# EAGLE design LTC6811_slave_12s_rev1 (EAGLE 9.3.1)

## Sheet 1 of 2
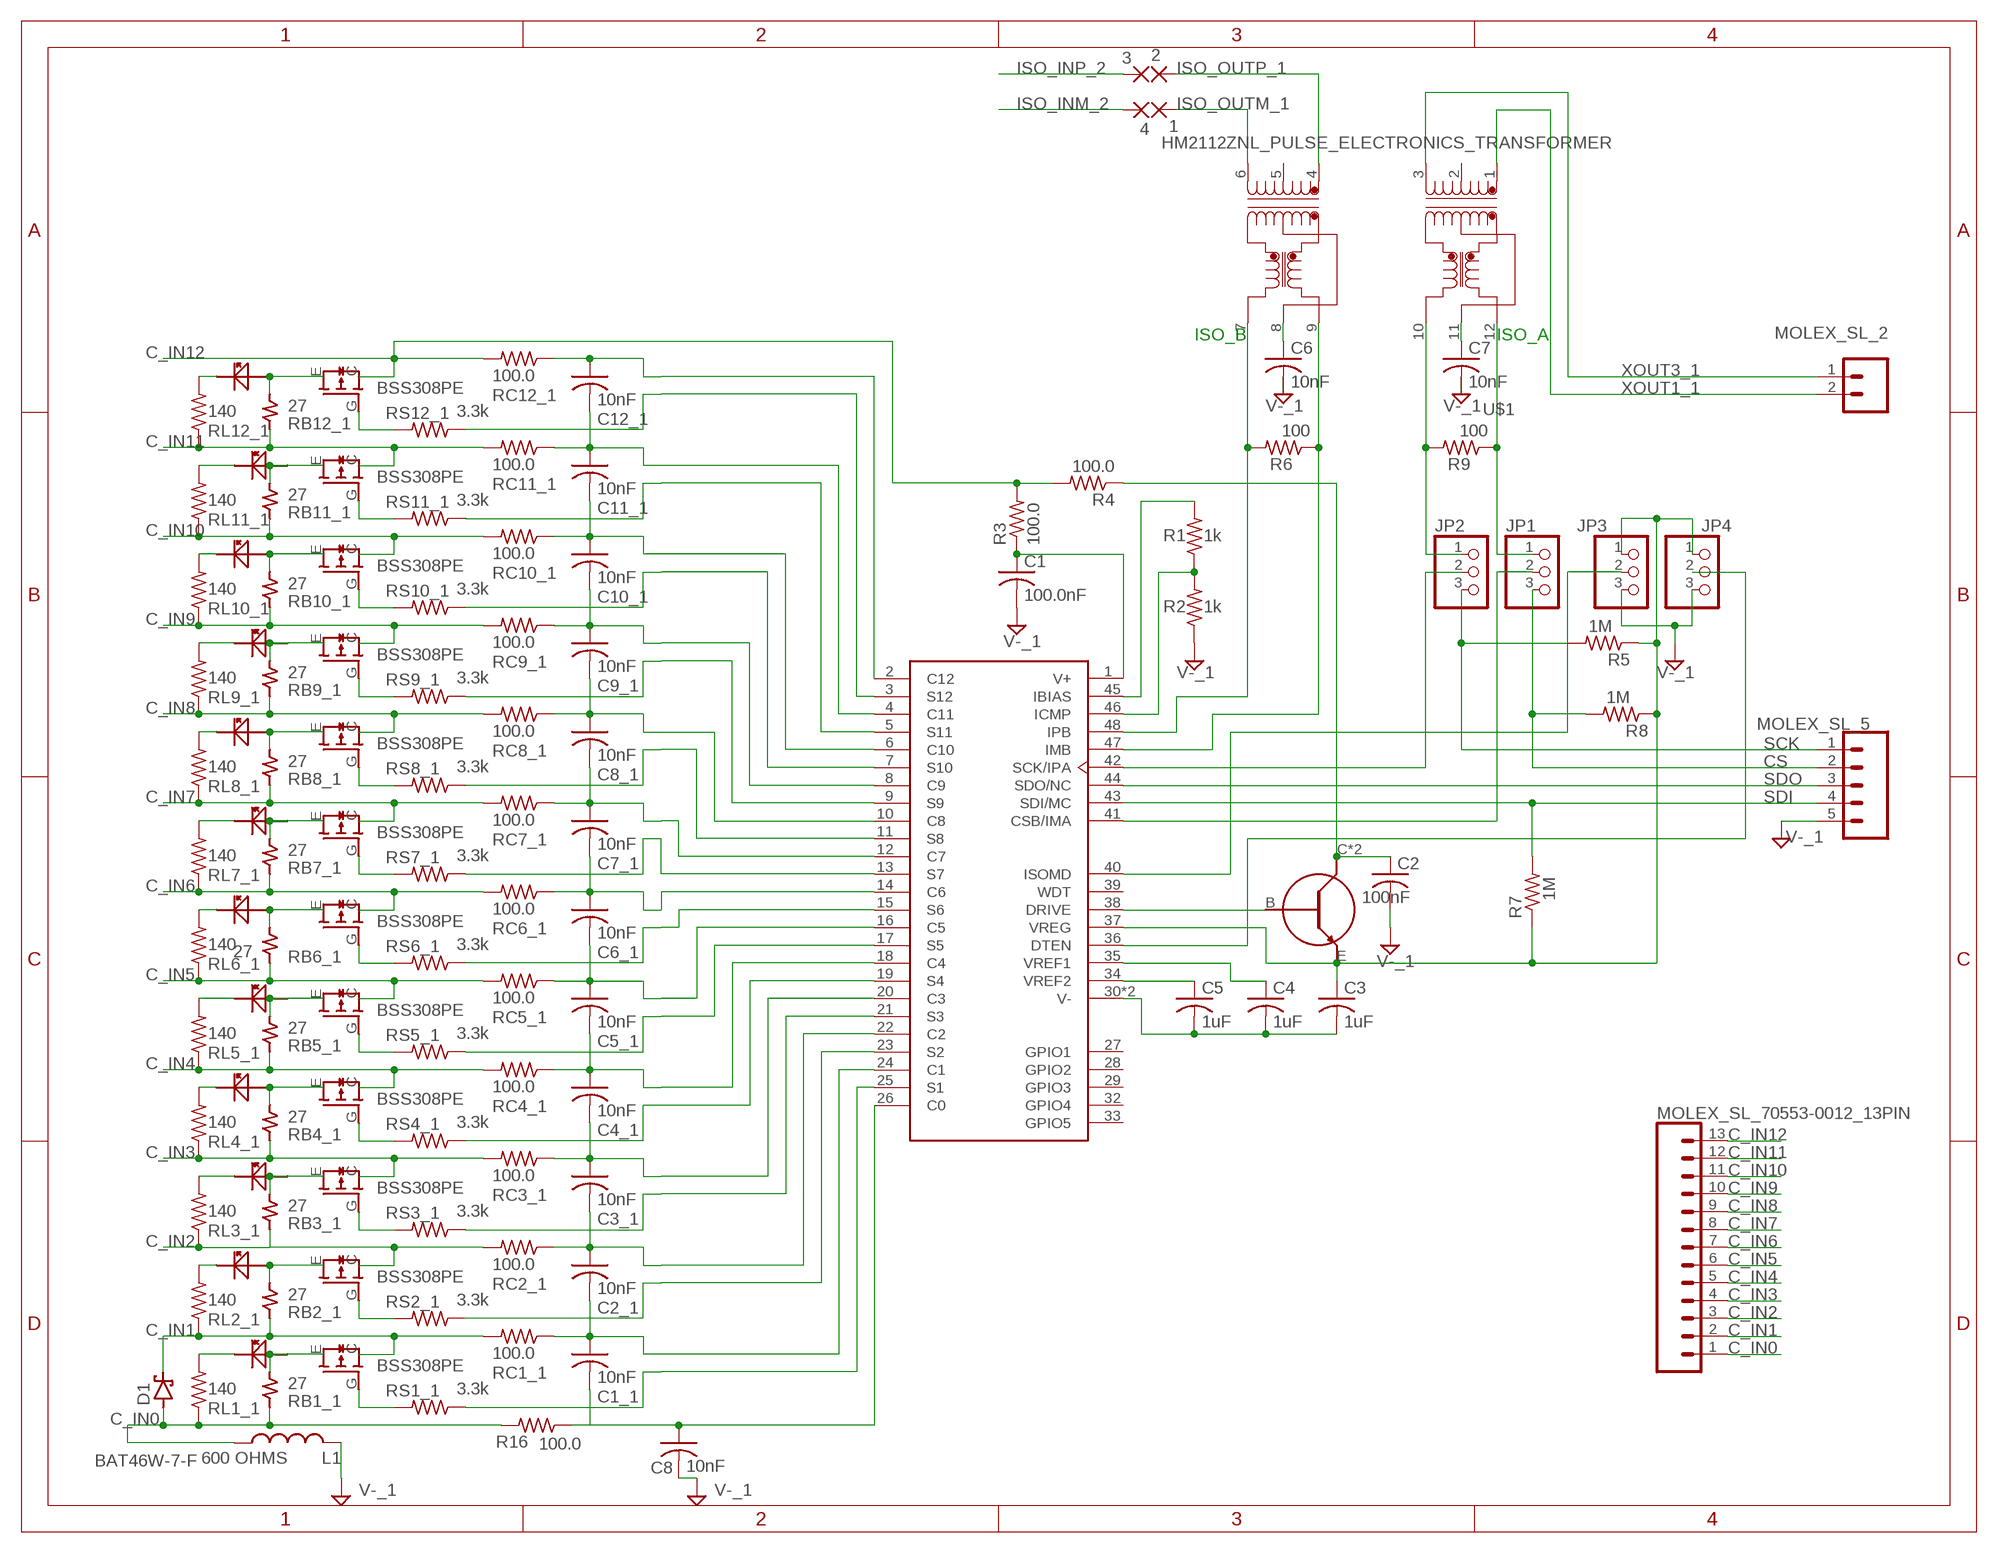
[diagram p0: schematic, sheet 1]

### Parts
1  WIREPAD2,15/1,0  [2,15/1,0]
2  WIREPAD2,15/1,0  [2,15/1,0]
3  WIREPAD2,15/1,0  [2,15/1,0]
4  WIREPAD2,15/1,0  [2,15/1,0]
C1  100.0nF  C-USC0805  [C0805]
C1_1  10nF  C-USC0805  [C0805]
C2  100nF  C-USC0805  [C0805]
C2_1  10nF  C-USC0805  [C0805]
C3  1uF  C-USC0805  [C0805]
C3_1  10nF  C-USC0805  [C0805]
C4  1uF  C-USC0805  [C0805]
C4_1  10nF  C-USC0805  [C0805]
C5  1uF  C-USC0805  [C0805]
C5_1  10nF  C-USC0805  [C0805]
C6  10nF  C-USC0805  [C0805]
C6_1  10nF  C-USC0805  [C0805]
C7  10nF  C-USC0805  [C0805]
C7_1  10nF  C-USC0805  [C0805]
C8  10nF  C-USC0805  [C0805]
C8_1  10nF  C-USC0805  [C0805]
C9_1  10nF  C-USC0805  [C0805]
C10_1  10nF  C-USC0805  [C0805]
C11_1  10nF  C-USC0805  [C0805]
C12_1  10nF  C-USC0805  [C0805]
D1  BAT46W-7-F  [SOD123]
DZT5551-13  DZT5551-13  [SOT223-4]
JP1  PINHD-1X3  [1X03]
JP2  PINHD-1X3  [1X03]
JP3  PINHD-1X3  [1X03]
JP4  PINHD-1X3  [1X03]
L1  600 OHMS  0805_FERRITEBEAD_INDUCTOR  [0805_COMPONENT]
LED1_3  LED_0805  [0805_COMPONENT]
LED1_4  LED_0805  [0805_COMPONENT]
LED1_5  LED_0805  [0805_COMPONENT]
LED1_6  LED_0805  [0805_COMPONENT]
LED1_7  LED_0805  [0805_COMPONENT]
LED1_8  LED_0805  [0805_COMPONENT]
LED1_9  LED_0805  [0805_COMPONENT]
LED1_10  LED_0805  [0805_COMPONENT]
LED1_11  LED_0805  [0805_COMPONENT]
LED1_12  LED_0805  [0805_COMPONENT]
LED1_13  LED_0805  [0805_COMPONENT]
LED1_14  LED_0805  [0805_COMPONENT]
MOLEX_SL_2  CONN_02  [1X02]
MOLEX_SL_5  CONN_05  [1X05]
MOLEX_SL_70553-0012_13PIN  CONN_13  [1X13]
R1  1k  R-US_R0805  [R0805]
R2  1k  R-US_R0805  [R0805]
R3  100.0  R-US_R0805  [R0805]
R4  100.0  R-US_R0805  [R0805]
R5  1M  R-US_R0805  [R0805]
R6  100  R-US_R0805  [R0805]
R7  1M  R-US_R0805  [R0805]
R8  1M  R-US_R0805  [R0805]
R9  100  R-US_R0805  [R0805]
R16  100.0  R-US_R0805  [R0805]
RB1_1  27  2817_RESISTOR  [2817_COMPONENT]
RB2_1  27  2817_RESISTOR  [2817_COMPONENT]
RB3_1  27  2817_RESISTOR  [2817_COMPONENT]
RB4_1  27  2817_RESISTOR  [2817_COMPONENT]
RB5_1  27  2817_RESISTOR  [2817_COMPONENT]
RB6_1  27  2817_RESISTOR  [2817_COMPONENT]
RB7_1  27  2817_RESISTOR  [2817_COMPONENT]
RB8_1  27  2817_RESISTOR  [2817_COMPONENT]
RB9_1  27  2817_RESISTOR  [2817_COMPONENT]
RB10_1  27  2817_RESISTOR  [2817_COMPONENT]
RB11_1  27  2817_RESISTOR  [2817_COMPONENT]
RB12_1  27  2817_RESISTOR  [2817_COMPONENT]
RC1_1  100.0  R-US_R0805  [R0805]
RC2_1  100.0  R-US_R0805  [R0805]
RC3_1  100.0  R-US_R0805  [R0805]
RC4_1  100.0  R-US_R0805  [R0805]
RC5_1  100.0  R-US_R0805  [R0805]
RC6_1  100.0  R-US_R0805  [R0805]
RC7_1  100.0  R-US_R0805  [R0805]
RC8_1  100.0  R-US_R0805  [R0805]
RC9_1  100.0  R-US_R0805  [R0805]
RC10_1  100.0  R-US_R0805  [R0805]
RC11_1  100.0  R-US_R0805  [R0805]
RC12_1  100.0  R-US_R0805  [R0805]
RL1_1  140  R-US_R0805  [R0805]
RL2_1  140  R-US_R0805  [R0805]
RL3_1  140  R-US_R0805  [R0805]
RL4_1  140  R-US_R0805  [R0805]
RL5_1  140  R-US_R0805  [R0805]
RL6_1  140  R-US_R0805  [R0805]
RL7_1  140  R-US_R0805  [R0805]
RL8_1  140  R-US_R0805  [R0805]
RL9_1  140  R-US_R0805  [R0805]
RL10_1  140  R-US_R0805  [R0805]
RL11_1  140  R-US_R0805  [R0805]
RL12_1  140  R-US_R0805  [R0805]
RS1_1  3.3k  R-US_R0805  [R0805]
RS2_1  3.3k  R-US_R0805  [R0805]
RS3_1  3.3k  R-US_R0805  [R0805]
RS4_1  3.3k  R-US_R0805  [R0805]
RS5_1  3.3k  R-US_R0805  [R0805]
RS6_1  3.3k  R-US_R0805  [R0805]
RS7_1  3.3k  R-US_R0805  [R0805]
RS8_1  3.3k  R-US_R0805  [R0805]
RS9_1  3.3k  R-US_R0805  [R0805]
RS10_1  3.3k  R-US_R0805  [R0805]
RS11_1  3.3k  R-US_R0805  [R0805]
RS12_1  3.3k  R-US_R0805  [R0805]
T1_3  BSS308PEH6327  [SOT23]
T1_4  BSS308PEH6327  [SOT23]
T1_5  BSS308PEH6327  [SOT23]
T1_6  BSS308PEH6327  [SOT23]
T1_7  BSS308PEH6327  [SOT23]
T1_8  BSS308PEH6327  [SOT23]
T1_9  BSS308PEH6327  [SOT23]
T1_10  BSS308PEH6327  [SOT23]
T1_11  BSS308PEH6327  [SOT23]
T1_12  BSS308PEH6327  [SOT23]
T1_13  BSS308PEH6327  [SOT23]
T1_14  BSS308PEH6327  [SOT23]
U1  LTC6811HG-2#PBF  [LTC6811-1]
U$1  HM2112ZNL_PULSE_ELECTRONICS_TRANSFORMER  [HM2112ZNL_12SMT]

### Nets
C0: C8.1 R16.1 U1.26(C0)
C1: C1_1.1 C2_1.2 RC1_1.1 U1.24(C1)
C2: C2_1.1 C3_1.2 RC2_1.1 U1.22(C2)
C3: C3_1.1 C4_1.2 RC3_1.1 U1.20(C3)
C4: C4_1.1 C5_1.2 RC4_1.1 U1.18(C4)
C5: C5_1.1 C6_1.2 RC5_1.1 U1.16(C5)
C6: C6_1.1 C7_1.2 RC6_1.1 U1.14(C6)
C7: C7_1.1 C8_1.2 RC7_1.1 U1.12(C7)
C8: C8_1.1 C9_1.2 RC8_1.1 U1.10(C8)
C9: C9_1.1 C10_1.2 RC9_1.1 U1.8(C9)
C10: C10_1.1 C11_1.2 RC10_1.1 U1.6(C10)
C11: C11_1.1 C12_1.2 RC11_1.1 U1.4(C11)
C12: C12_1.1 RC12_1.1 U1.2(C12)
C_IN0: D1.A L1.1 MOLEX_SL_70553-0012_13PIN.1 R16.2 RB1_1.2 RL1_1.1
C_IN1: D1.C MOLEX_SL_70553-0012_13PIN.2 RB2_1.2 RC1_1.2 RL2_1.1 T1_3.C
C_IN2: MOLEX_SL_70553-0012_13PIN.3 RB3_1.2 RC2_1.2 RL3_1.1 T1_4.C
C_IN3: MOLEX_SL_70553-0012_13PIN.4 RB4_1.2 RC3_1.2 RL4_1.1 T1_7.C
C_IN4: MOLEX_SL_70553-0012_13PIN.5 RB5_1.2 RC4_1.2 RL5_1.1 T1_8.C
C_IN5: MOLEX_SL_70553-0012_13PIN.6 RB6_1.2 RC5_1.2 RL6_1.1 T1_5.C
C_IN6: MOLEX_SL_70553-0012_13PIN.7 RB7_1.2 RC6_1.2 RL7_1.1 T1_6.C
C_IN7: MOLEX_SL_70553-0012_13PIN.8 RB8_1.2 RC7_1.2 RL8_1.1 T1_9.C
C_IN8: MOLEX_SL_70553-0012_13PIN.9 RB9_1.2 RC8_1.2 RL9_1.1 T1_10.C
C_IN9: MOLEX_SL_70553-0012_13PIN.10 RB10_1.2 RC9_1.2 RL10_1.1 T1_11.C
C_IN10: MOLEX_SL_70553-0012_13PIN.11 RB11_1.2 RC10_1.2 RL11_1.1 T1_12.C
C_IN11: MOLEX_SL_70553-0012_13PIN.12 RB12_1.2 RC11_1.2 RL12_1.1 T1_13.C
C_IN12: MOLEX_SL_70553-0012_13PIN.13 R3.2 R4.2 RC12_1.2 T1_14.C
CS: JP1.3 MOLEX_SL_5.2 R8.2
CS_OR_IMA: JP1.2 U1.41(CSB/IMA)
DRIVE: DZT5551-13.B U1.38(DRIVE)
DTEN: JP4.2 U1.36(DTEN)
IBIAS: R1.2 U1.45(IBIAS)
ICMP: R1.1 R2.2 U1.46(ICMP)
IMB: R6.1 U1.47(IMB) U$1.9
IPB: R6.2 U1.48(IPB) U$1.7
ISO_INM_2: 4.1(P)
ISO_INP_2: 3.1(P)
ISO_OUTM_1: 1.1(P) U$1.6
ISO_OUTP_1: 2.1(P) U$1.4
ISOMD: JP3.2 U1.40(ISOMD)
N$3: C6.1 U$1.8
N$5: C1.1 R3.1 U1.1(V+)
N$7: JP2.1 R9.2 U$1.10
N$8: JP1.1 R9.1 U$1.12
N$9: C7.1 U$1.11
N$32: LED1_11.2 RB9_1.1 T1_11.E
N$33: RS9_1.2 T1_11.G(B)
N$34: LED1_11.1 RL9_1.2
N$35: LED1_12.2 RB10_1.1 T1_12.E
N$36: RS10_1.2 T1_12.G(B)
N$37: LED1_12.1 RL10_1.2
N$39: LED1_13.2 RB11_1.1 T1_13.E
N$40: LED1_3.2 RB1_1.1 T1_3.E
N$41: RS1_1.2 T1_3.G(B)
N$42: LED1_3.1 RL1_1.2
N$43: LED1_4.2 RB2_1.1 T1_4.E
N$44: RS2_1.2 T1_4.G(B)
N$45: LED1_4.1 RL2_1.2
N$46: C1_1.2
N$48: LED1_5.2 RB5_1.1 T1_5.E
N$49: RS5_1.2 T1_5.G(B)
N$50: LED1_5.1 RL5_1.2
N$51: LED1_6.2 RB6_1.1 T1_6.E
N$52: RS6_1.2 T1_6.G(B)
N$53: LED1_6.1 RL6_1.2
N$55: LED1_9.2 RB7_1.1 T1_9.E
N$56: LED1_7.2 RB3_1.1 T1_7.E
N$57: RS3_1.2 T1_7.G(B)
N$58: LED1_7.1 RL3_1.2
N$59: LED1_8.2 RB4_1.1 T1_8.E
N$60: RS4_1.2 T1_8.G(B)
N$61: LED1_8.1 RL4_1.2
N$62: RS11_1.2 T1_13.G(B)
N$63: RS7_1.2 T1_9.G(B)
N$64: LED1_9.1 RL7_1.2
N$65: LED1_10.2 RB8_1.1 T1_10.E
N$66: RS8_1.2 T1_10.G(B)
N$67: LED1_10.1 RL8_1.2
N$69: LED1_13.1 RL11_1.2
N$70: LED1_14.2 RB12_1.1 T1_14.E
N$71: RS12_1.2 T1_14.G(B)
N$72: LED1_14.1 RL12_1.2
S1: RS1_1.1 U1.25(S1)
S2: RS2_1.1 U1.23(S2)
S3: RS3_1.1 U1.21(S3)
S4: RS4_1.1 U1.19(S4)
S5: RS5_1.1 U1.17(S5)
S6: RS6_1.1 U1.15(S6)
S7: RS7_1.1 U1.13(S7)
S8: RS8_1.1 U1.11(S8)
S9: RS9_1.1 U1.9(S9)
S10: RS10_1.1 U1.7(S10)
S11: RS11_1.1 U1.5(S11)
S12: RS12_1.1 U1.3(S12)
SCK: JP2.3 MOLEX_SL_5.1 R5.2
SCK_OR_IPA: JP2.2 U1.42(SCK/IPA)
SDI: MOLEX_SL_5.4 R7.2 U1.43(SDI/MC)
SDO: MOLEX_SL_5.3 U1.44(SDO/NC)
V-_1: C1.2 C2.2 C3.2 C4.2 C5.2 C6.2 C7.2 C8.2 JP3.3 JP4.3 L1.2 MOLEX_SL_5.5 R2.1 U1.30(V-) U1.31(V-) ; supply symbol labelled GND
VREF1_C4: C4.1 U1.35(VREF1)
VREF2_C5: C5.1 U1.34(VREF2)
VREG: C3.1 DZT5551-13.E JP3.1 JP4.1 R5.1 R7.1 R8.1 U1.37(VREG)
VREG_CAP: C2.1 DZT5551-13.C DZT5551-13.C@2(C) R4.1
XOUT1_1: MOLEX_SL_2.2 U$1.1
XOUT3_1: MOLEX_SL_2.1 U$1.3
Unconnected: U1.27(GPIO1) U1.28(GPIO2) U1.29(GPIO3) U1.32(GPIO4) U1.33(GPIO5) U1.39(WDT) U$1.2 U$1.5

### Notes on the sheet
- ISO_B | ISO_A

## Sheet 2 of 2

## Library data of the parts
1-4 = wirepad:WIREPAD: Wire PAD connect wire on PCB
C1 C1_1 C2 C2_1 C3 C3_1 C4 C4_1 C5 C5_1 C6 C6_1 C7 C7_1 C8 C8_1 C9_1 C10_1 C11_1 C12_1 = resistor:C-US: CAPACITOR, American symbol
D1 = Library_Capstone:BAT46W-7-F
DZT5551-13 = Library_Capstone:DZT5551-13
JP1-JP4 = pinhead:PINHD-1X3: PIN HEADER
L1 = Library_Capstone:0805_FERRITEBEAD_INDUCTOR
LED1_3-LED1_14 = Library_Capstone:LED_0805
MOLEX_SL_2 = SparkFun-Connectors:CONN_02: Multi connection point. Often used as Generic Header-pin footprint for 0.1 inch spaced/style header connections On any of the 0.1 inch spaced packages, you can populate with these: Break Away Headers - Straight <https://www.sparkfun.com/products/116> (PRT-00116) Break Away Male Headers - Right Angle <https://www.sparkfun.com/products/553> (PRT-00553) Female Headers <https://www.sparkfun.com/products/115> (PRT-00115) Break Away Headers - Machine Pin <https://www.sparkfun.com/products/117> (PRT-00117) Break Away Female Headers - Swiss Machine Pin <https://www.sparkfun.com/products/743> (PRT-00743) For SCREWTERMINALS and SPRING TERMINALS visit here: Screw Terimnals on SparkFun.com <https://www.sparkfun.com/search/results?term=Screw+Terminals> (5mm/3.5mm/2.54mm spacing) This device is also useful as a general connection point to wire up your design to another part of your project. Our various solder wires solder well into these plated through hole pads. Hook-Up Wire - Assortment (Stranded, 22 AWG) <https://www.sparkfun.com/products/11375> (PRT-11375) Hook-Up Wire - Assortment (Solid Core, 22 AWG) <https://www.sparkfun.com/products/11367> (PRT-11367) View the entire wire category on our website here <https://www.sparkfun.com/categories/141> Special notes: Molex polarized connector foot print use with: PRT-08233 with associated crimp pins and housings. 2.54_SCREWTERM for use with PRT-10571. 3.5mm Screw Terminal footprints for PRT-08084 5mm Screw Terminal footprints for use with PRT-08432
MOLEX_SL_5 = SparkFun-Connectors:CONN_05: Multi connection point. Often used as Generic Header-pin footprint for 0.1 inch spaced/style header connections On any of the 0.1 inch spaced packages, you can populate with these: Break Away Headers - Straight <https://www.sparkfun.com/products/116> (PRT-00116) Break Away Male Headers - Right Angle <https://www.sparkfun.com/products/553> (PRT-00553) Female Headers <https://www.sparkfun.com/products/115> (PRT-00115) Break Away Headers - Machine Pin <https://www.sparkfun.com/products/117> (PRT-00117) Break Away Female Headers - Swiss Machine Pin <https://www.sparkfun.com/products/743> (PRT-00743) For SCREWTERMINALS and SPRING TERMINALS visit here: Screw Terimnals on SparkFun.com <https://www.sparkfun.com/search/results?term=Screw+Terminals> (5mm/3.5mm/2.54mm spacing) This device is also useful as a general connection point to wire up your design to another part of your project. Our various solder wires solder well into these plated through hole pads. Hook-Up Wire - Assortment (Stranded, 22 AWG) <https://www.sparkfun.com/products/11375> (PRT-11375) Hook-Up Wire - Assortment (Solid Core, 22 AWG) <https://www.sparkfun.com/products/11367> (PRT-11367) View the entire wire category on our website here <https://www.sparkfun.com/categories/141> Special notes: Molex polarized connector foot print use with SKU : PRT-08231 with associated crimp pins and housings. 1MM SMD Version SKU: PRT-10208
MOLEX_SL_70553-0012_13PIN = SparkFun-Connectors:CONN_13: Multi connection point. Often used as Generic Header-pin footprint for 0.1 inch spaced/style header connections On any of the 0.1 inch spaced packages, you can populate with these: Break Away Headers - Straight <https://www.sparkfun.com/products/116> (PRT-00116) Break Away Male Headers - Right Angle <https://www.sparkfun.com/products/553> (PRT-00553) Female Headers <https://www.sparkfun.com/products/115> (PRT-00115) Break Away Headers - Machine Pin <https://www.sparkfun.com/products/117> (PRT-00117) Break Away Female Headers - Swiss Machine Pin <https://www.sparkfun.com/products/743> (PRT-00743) For SCREWTERMINALS and SPRING TERMINALS visit here: Screw Terimnals on SparkFun.com <https://www.sparkfun.com/search/results?term=Screw+Terminals> (5mm/3.5mm/2.54mm spacing) This device is also useful as a general connection point to wire up your design to another part of your project. Our various solder wires solder well into these plated through hole pads. Hook-Up Wire - Assortment (Stranded, 22 AWG) <https://www.sparkfun.com/products/11375> (PRT-11375) Hook-Up Wire - Assortment (Solid Core, 22 AWG) <https://www.sparkfun.com/products/11367> (PRT-11367) View the entire wire category on our website here <https://www.sparkfun.com/categories/141> Special notes: Molex polarized connector foot print use with SKU : PRT-08231 with associated crimp pins and housings. 1MM SMD Version SKU: PRT-10208 NOTES ON THE VARIANTS LOCK and LOCK_LONGPADS... This footprint was designed to help hold the alignment of a through-hole component (i.e. 6-pin header) while soldering it into place. You may notice that each hole has been shifted either up or down by 0.005 of an inch from it's more standard position (which is a perfectly straight line). This slight alteration caused the pins (the squares in the middle) to touch the edges of the holes. Because they are alternating, it causes a "brace" to hold the component in place. 0.005 has proven to be the perfect amount of "off-center" position when using our standard breakaway headers. Although looks a little odd when you look at the bare footprint, once you have a header in there, the alteration is very hard to notice. Also,if you push a header all the way into place, it is covered up entirely on the bottom side.
R1-R9 R16 RC1_1 RC2_1 RC3_1 RC4_1 RC5_1 RC6_1 RC7_1 RC8_1 RC9_1 RC10_1 RC11_1 RC12_1 RL1_1 RL2_1 RL3_1 RL4_1 RL5_1 RL6_1 RL7_1 RL8_1 RL9_1 RL10_1 RL11_1 RL12_1 RS1_1 RS2_1 RS3_1 RS4_1 RS5_1 RS6_1 RS7_1 RS8_1 RS9_1 RS10_1 RS11_1 RS12_1 = resistor:R-US_: RESISTOR, American symbol
RB1_1 RB2_1 RB3_1 RB4_1 RB5_1 RB6_1 RB7_1 RB8_1 RB9_1 RB10_1 RB11_1 RB12_1 = Library_Capstone:2817_RESISTOR
T1_3-T1_14 = Library_Capstone:BSS308PEH6327
U1 = LTC6811HG-2_PBF:LTC6811HG-2#PBF: LTC6811-1/LTC6811-2 - Multicell Battery Monitors; AVAILABILITY: Unavailable; DESCRIPTION: LTC6811-1/LTC6811-2 - Multicell Battery Monitors; MF: Linear Technology/Analog; MP: LTC6811HG-2#PBF; PACKAGE: SSOP-48 Linear Technology; PRICE: None
U$1 = HM2112ZNL:HM2112ZNL_PULSE_ELECTRONICS_TRANSFORMER

## Board
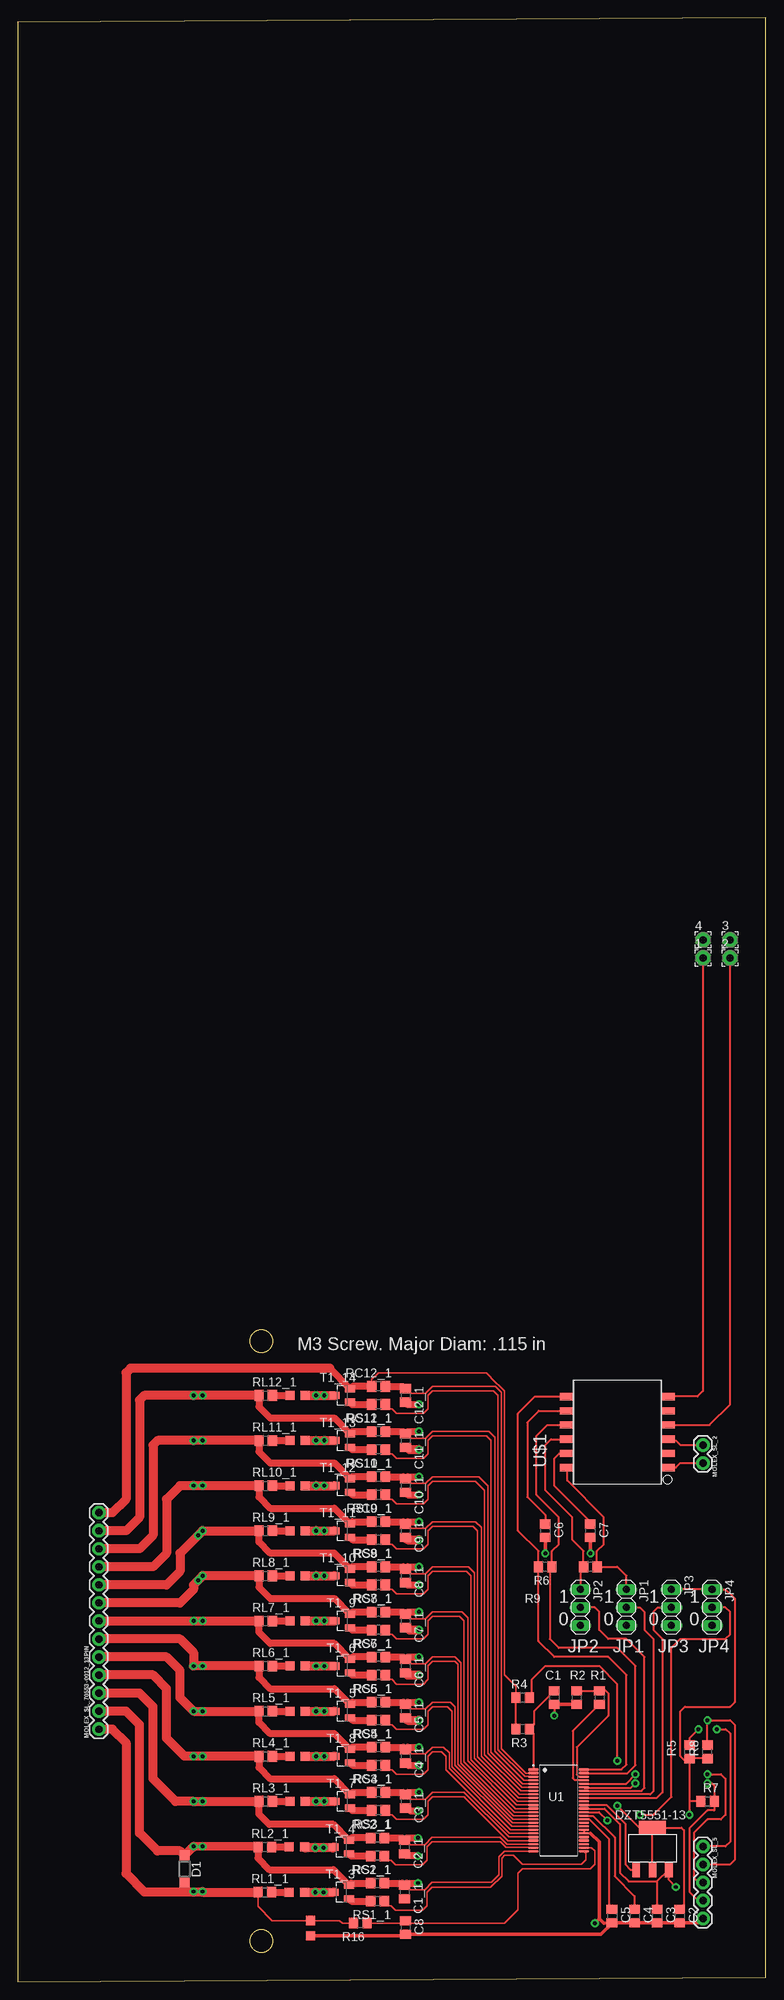
[diagram p1: board, top side]
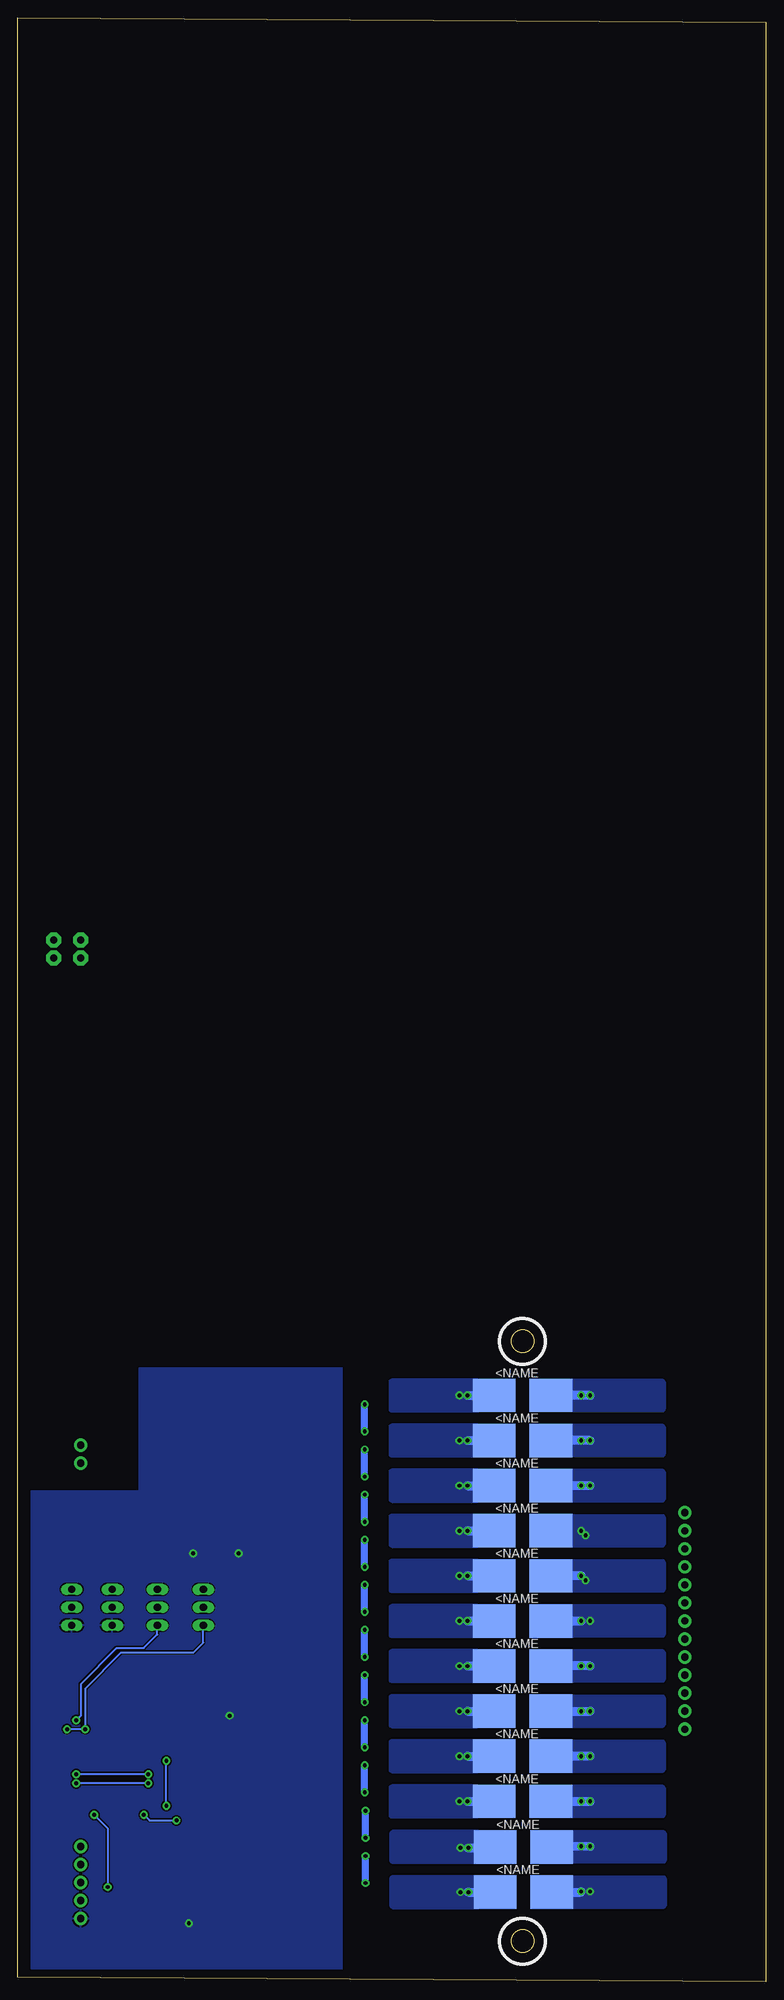
[diagram p2: board, bottom side, seen from below]

Size 105.39 x 276.53 mm. Coordinates in mm from the lower left corner, seen from the top.
Outline: 0,0 105.39,0.64 105.39,276.53 0,275.89 0,0
Outline: circle at 34.29,90.17 radius 1.59
Outline: circle at 34.29,5.72 radius 1.59
Copper layers (1*16): Top 0.035mm / dielectric 1.5mm / Bottom 0.035mm
Design rules "default *": minimum track width 6mil, minimum drill 0.53mm, track to track 8mil, track to pad 6mil, pad to pad 6mil, via to via 6mil, smd to smd 6mil, copper to edge 40mil, drill to drill 6mil, minimum pad ring 10mil, minimum via ring 8mil, stop-mask expansion 4mil, vias tented up to drill 0mil, thermal gap 10mil

### Footprints (pad centres in the part's own frame; a part is rotated, then mirrored left to right if it is on the bottom)
2,15/1,0 = drill 1.016 pad 2.159 octagon: 1 0,0
C0805 = smd 1.3 x 1.5: 1 -0.95,0; 2 0.95,0
SOD123 = smd 1.4 x 1.4: A 1.9,0; C -1.9,0
SOT223-4 = smd 1.067 x 2.184: B -2.3,-3; C@2 0,-3; E 2.3,-3 | smd 3.81 x 1.93: C 0,2.9
1X03 = drill 1.016 long: 1 -2.54,0; 2 0,0; 3 2.54,0
0805_COMPONENT = smd 1.27 x 1.27: 1 -1,0; 2 1.127,0
1X02 = drill 1.016 pad 1.88: 1 0,0; 2 2.54,0
1X05 = drill 1.016 pad 1.88: 1 0,0; 2 2.54,0; 3 5.08,0; 4 7.62,0; 5 10.16,0
1X13 = drill 1.016 pad 1.88: 1 0,0; 2 2.54,0; 3 5.08,0; 4 7.62,0; 5 10.16,0; 6 12.7,0; 7 15.24,0; 8 17.78,0; 9 20.32,0; 10 22.86,0; 11 25.4,0; 12 27.94,0; 13 30.48,0
R0805 = smd 1.3 x 1.5: 1 -0.95,0; 2 0.95,0
2817_COMPONENT = smd 6 x 4.7: 1 -4,0; 2 4,0
SOT23 = smd 1 x 1.4: C 0.95,-1.1; E 0,1.1; G -0.95,-1.1
LTC6811-1 = smd 1.44 x 0.34: 1 -3.54,5.75; 2 -3.54,5.25; 3 -3.54,4.75; 4 -3.54,4.25; 5 -3.54,3.75; 6 -3.54,3.25; 7 -3.54,2.75; 8 -3.54,2.25; 9 -3.54,1.75; 10 -3.54,1.25; 11 -3.54,0.75; 12 -3.54,0.25; 13 -3.54,-0.25; 14 -3.54,-0.75; 15 -3.54,-1.25; 16 -3.54,-1.75; 17 -3.54,-2.25; 18 -3.54,-2.75; 19 -3.54,-3.25; 20 -3.54,-3.75; 21 -3.54,-4.25; 22 -3.54,-4.75; 23 -3.54,-5.25; 24 -3.54,-5.75; 25 3.54,-5.75; 26 3.54,-5.25; 27 3.54,-4.75; 28 3.54,-4.25; 29 3.54,-3.75; 30 3.54,-3.25; 31 3.54,-2.75; 32 3.54,-2.25; 33 3.54,-1.75; 34 3.54,-1.25; 35 3.54,-0.75; 36 3.54,-0.25; 37 3.54,0.25; 38 3.54,0.75; 39 3.54,1.25; 40 3.54,1.75; 41 3.54,2.25; 42 3.54,2.75; 43 3.54,3.25; 44 3.54,3.75; 45 3.54,4.25; 46 3.54,4.75; 47 3.54,5.25; 48 3.54,5.75
HM2112ZNL_12SMT = smd 1.02 x 1.89: 1 0,-7.145; 2 2,-7.145; 3 4,-7.145; 4 6,-7.145; 5 8,-7.145; 6 10,-7.145; 7 10,7.145; 8 8,7.145; 9 6,7.145; 10 4,7.145; 11 2,7.145; 12 0,7.145

### Placement (x,y rotation side)
1  96.52,144.14 0 top
2  100.33,144.14 0 top
3  100.33,146.69 0 top
4  96.52,146.69 0 top
C1  75.56,40.01 270 top
C1_1  54.48,12.62 270 top
C2  93.22,9.27 270 top
C2_1  54.48,18.97 270 top
C3  90.04,9.27 270 top
C3_1  54.61,25.4 270 top
C4  86.87,9.27 270 top
C4_1  54.61,31.75 270 top
C5  83.69,9.27 270 top
C5_1  54.61,38.1 270 top
C6  74.3,63.5 270 top
C6_1  54.61,44.45 270 top
C7  80.64,63.5 270 top
C7_1  54.61,50.8 270 top
C8  54.61,7.62 270 top
C8_1  54.61,57.15 270 top
C9_1  54.61,63.5 270 top
C10_1  54.61,69.85 270 top
C11_1  54.61,76.2 270 top
C12_1  54.61,82.55 270 top
D1  23.5,15.88 270 top
DZT5551-13  89.41,18.8 0 top
JP1  85.72,52.71 270 top
JP2  79.25,52.71 270 top
JP3  92.08,52.71 270 top
JP4  97.79,52.71 270 top
L1  41.27,7.62 270 top
LED1_3  39.24,12.62 0 top
LED1_4  39.24,18.97 0 top
LED1_5  39.37,38.1 0 top
LED1_6  39.37,44.45 0 top
LED1_7  39.37,25.4 0 top
LED1_8  39.37,31.75 0 top
LED1_9  39.37,50.8 0 top
LED1_10  39.37,57.15 0 top
LED1_11  39.37,63.5 0 top
LED1_12  39.37,69.85 0 top
LED1_13  39.37,76.2 0 top
LED1_14  39.37,82.55 0 top
MOLEX_SL_2  96.52,75.56 270 top
MOLEX_SL_5  96.52,19.05 270 top
MOLEX_SL_70553-0012_13PIN  11.43,35.56 90 top
R1  81.91,40.01 270 top
R2  78.74,40.01 90 top
R3  71.12,35.56 180 top
R4  71.12,40.01 180 top
R5  94.61,32.39 90 top
R6  74.3,58.42 180 top
R7  97.16,25.4 0 top
R8  97.16,32.39 90 top
R9  80.64,58.42 180 top
R16  48.26,8.25 180 top
RB1_1  34.16,12.62 0 bottom
RB2_1  34.16,18.97 0 bottom
RB3_1  34.29,25.4 0 bottom
RB4_1  34.29,31.75 0 bottom
RB5_1  34.29,38.1 0 bottom
RB6_1  34.29,44.45 0 bottom
RB7_1  34.29,50.8 0 bottom
RB8_1  34.29,57.15 0 bottom
RB9_1  34.29,63.5 0 bottom
RB10_1  34.29,69.85 0 bottom
RB11_1  34.29,76.2 0 bottom
RB12_1  34.29,82.55 0 bottom
RC1_1  50.67,13.89 180 top
RC2_1  50.67,20.24 180 top
RC3_1  50.8,26.67 180 top
RC4_1  50.8,33.02 180 top
RC5_1  50.8,39.37 180 top
RC6_1  50.8,45.72 180 top
RC7_1  50.8,52.07 180 top
RC8_1  50.8,58.42 180 top
RC9_1  50.8,64.77 180 top
RC10_1  50.8,71.12 180 top
RC11_1  50.8,77.47 180 top
RC12_1  50.8,83.82 180 top
RL1_1  34.8,12.62 0 top
RL2_1  34.8,18.97 0 top
RL3_1  34.92,25.4 0 top
RL4_1  34.92,31.75 0 top
RL5_1  34.92,38.1 0 top
RL6_1  34.92,44.45 0 top
RL7_1  34.92,50.8 0 top
RL8_1  34.92,57.15 0 top
RL9_1  34.92,63.5 0 top
RL10_1  34.92,69.85 0 top
RL11_1  34.92,76.2 0 top
RL12_1  34.92,82.55 0 top
RS1_1  50.67,11.35 180 top
RS2_1  50.67,17.7 180 top
RS3_1  50.8,24.13 180 top
RS4_1  50.8,30.48 180 top
RS5_1  50.8,36.83 180 top
RS6_1  50.8,43.18 180 top
RS7_1  50.8,49.53 180 top
RS8_1  50.8,55.88 180 top
RS9_1  50.8,62.23 180 top
RS10_1  50.8,68.58 180 top
RS11_1  50.8,74.93 180 top
RS12_1  50.8,81.28 180 top
T1_3  45.59,12.62 90 top
T1_4  45.59,18.97 90 top
T1_5  45.72,38.1 90 top
T1_6  45.72,44.45 90 top
T1_7  45.72,25.4 90 top
T1_8  45.72,31.75 90 top
T1_9  45.72,50.8 90 top
T1_10  45.72,57.15 90 top
T1_11  45.72,63.5 90 top
T1_12  45.72,69.85 90 top
T1_13  45.72,76.2 90 top
T1_14  45.72,82.55 90 top
U1  76.2,24.13 0 top
U$1  84.45,72.39 90 top

### Tracks (layer width: path | path; a pad name or v marks a point on that pad's centre or on a via)
C0
  Top 0.203: U1.26 80.81,18.88 81.28,18.41 81.28,16.51 80.64,15.88 71.12,15.88 70.48,15.24 70.48,10.16 68.58,8.25 54.92,8.25 C8.1 54.3,8.25 R16.1
C1  (via drill 0.55 pad 1.1)
  Top 0.203: C1_1.1 55.12,12.94 57.34,12.94 58.37,13.97 66.69,13.97 67.77,15.05 67.77,17.6 68.55,18.38 U1.24
  Top 1.016: RC1_1.1 54.16,13.89 C1_1.1 54.8,13.89 v56.39,13.89 | C2_1.2 54.73,17.78 56.31,17.78 v56.39,17.7
  Bottom 1.016: v56.39,13.89 v56.39,17.7
C2  (via drill 0.55 pad 1.1)
  Top 0.203: C2_1.1 55.12,19.29 57.34,19.29 58.37,20.32 67.94,20.32 68.88,19.38 U1.22
  Top 1.016: RC2_1.1 54.16,20.24 C2_1.1 54.8,20.24 v56.39,20.24 | C3_1.2 54.92,24.45 55.32,24.05 v56.39,24.05
  Bottom 1.016: v56.39,20.24 v56.39,24.05
C3  (via drill 0.55 pad 1.1)
  Top 0.203: C3_1.1 55.24,25.71 57.46,25.71 58.42,26.67 62.86,26.67 69.16,20.38 U1.20
  Top 1.016: RC3_1.1 54.29,26.67 C3_1.1 54.93,26.67 v56.52,26.67 | C4_1.2 54.93,30.48 v56.52,30.48
  Bottom 1.016: v56.52,26.67 v56.52,30.48
C4  (via drill 0.55 pad 1.1)
  Top 0.203: C4_1.1 55.24,32.07 57.46,32.07 58.42,33.02 59.98,33.02 60.78,32.22 60.78,30.02 69.42,21.38 U1.18
  Top 1.016: RC4_1.1 54.29,33.02 C4_1.1 54.93,33.02 v56.52,33.02
  Top 1.27: C5_1.2 54.93,36.83 v56.52,36.83
  Bottom 1.016: v56.52,33.02 v56.52,36.83
C5  (via drill 0.55 pad 1.1)
  Top 0.203: C5_1.1 55.24,38.41 57.46,38.41 58.42,39.37 60.96,39.37 61.59,38.73 61.59,30.45 69.66,22.38 U1.16
  Top 1.016: RC5_1.1 54.29,39.37 C5_1.1 54.93,39.37 v56.52,39.37
  Top 1.27: C6_1.2 54.93,43.18 v56.52,43.18
  Bottom 1.016: v56.52,39.37 v56.52,43.18
C6  (via drill 0.55 pad 1.1)
  Top 0.203: C6_1.1 55.24,44.77 57.46,44.77 58.42,45.72 61.58,45.72 62.41,44.9 62.41,30.79 69.81,23.38 U1.14
  Top 1.016: RC6_1.1 54.29,45.72 C6_1.1 54.93,45.72 v56.52,45.72
  Top 1.27: C7_1.2 54.92,49.85 55.24,49.53 v56.52,49.53
  Bottom 1.016: v56.52,45.72 v56.52,49.53
C7  (via drill 0.55 pad 1.1)
  Top 0.203: C7_1.1 55.24,51.12 57.46,51.12 58.42,52.07 62.57,52.07 63.4,51.25 63.4,31.09 70.11,24.38 U1.12
  Top 1.016: RC7_1.1 54.29,52.07 C7_1.1 54.93,52.07 v56.52,52.07 | C8_1.2 54.93,55.88 v56.52,55.88
  Bottom 1.016: v56.52,52.07 v56.52,55.88
C8  (via drill 0.55 pad 1.1)
  Top 0.203: C8_1.1 55.24,57.46 57.46,57.46 58.42,58.42 63.49,58.42 64.31,57.6 64.31,31.47 70.4,25.38 | U1.10 70.4,25.38 | 70.4,25.38
  Top 1.016: RC8_1.1 54.29,58.42 C8_1.1 54.93,58.42 v56.52,58.42
  Top 1.27: C9_1.2 54.93,62.23 v56.52,62.23
  Bottom 1.016: v56.52,58.42 v56.52,62.23
C9  (via drill 0.55 pad 1.1)
  Top 0.203: C9_1.1 55.24,63.82 57.46,63.82 58.42,64.77 64.48,64.77 65.3,63.95 65.3,31.77 70.69,26.38 U1.8
  Top 1.016: RC9_1.1 54.29,64.77 C9_1.1 54.93,64.77 v56.52,64.77 | C10_1.2 54.93,68.58 v56.52,68.58
  Bottom 1.016: v56.52,64.77 v56.52,68.58
C10  (via drill 0.55 pad 1.1)
  Top 0.203: C10_1.1 55.24,70.16 57.46,70.16 58.42,71.12 64.95,71.12 66.22,69.85 66.22,32.15 70.99,27.38 U1.6
  Top 1.016: RC10_1.1 54.29,71.12 C10_1.1 54.93,71.12 v56.52,71.12
  Top 1.27: C11_1.2 54.92,75.25 55.24,74.93 v56.52,74.93
  Bottom 1.016: v56.52,71.12 v56.52,74.93
C11  (via drill 0.55 pad 1.1)
  Top 0.203: C11_1.1 55.24,76.52 57.46,76.52 58.42,77.47 66.38,77.47 67.21,76.65 67.21,32.45 71.28,28.38 U1.4
  Top 1.016: RC11_1.1 54.29,77.47 C11_1.1 54.93,77.47 v56.52,77.47 | C12_1.2 54.93,81.28 v56.52,81.28
  Bottom 1.016: v56.52,77.47 v56.52,81.28
C12
  Top 0.203: C12_1.1 55.24,82.86 57.46,82.86 58.42,83.82 67.3,83.82 68.12,83 68.12,32.83 71.57,29.38 U1.2
  Top 1.016: RC12_1.1 54.29,83.82 C12_1.1
C_IN0  (via drill 0.55 pad 1.1)
  Top 0.203: RL1_1.1 33.85,10.6 35.83,8.62 L1.1 45.35,8.62 45.72,8.25 R16.2
  Top 1.27: MOLEX_SL_70553-0012_13PIN.1 13.33,35.56 15.24,33.66 15.24,15.24 17.86,12.62 23.5,12.62 | RL1_1.1 26.11,12.62 v26.04,12.7 25.96,12.62 23.5,12.62 | D1.A 23.5,12.62
  Bottom 1.27: RB1_1.2 26.11,12.62 v26.04,12.7
  other vias: 24.76,12.7
  pour Bottom (no thermals): 27.81,13.89 27.81,14.53 14.48,14.53 14.48,10.72 27.81,10.72
C_IN1  (via drill 0.55 pad 1.1)
  Top 1.016: RC1_1.2 47.01,13.89 T1_3.C 44.47,15.8 35.43,15.8 33.85,17.38 RL2_1.1
  Top 1.27: RL2_1.1 v24.76,19.05 24.64,18.92 D1.C 22.86,18.41 19.68,18.41 17.14,20.95 17.14,36.2 15.24,38.1 MOLEX_SL_70553-0012_13PIN.2
  Bottom 1.27: v24.76,19.05 RB2_1.2
  other vias: 26.04,19.05
  pour Bottom (no thermals): 27.81,20.88 14.48,20.88 14.48,17.07 27.81,17.07
C_IN2  (via drill 0.55 pad 1.1)
  Top 1.016: RC2_1.2 47.01,20.24 T1_4.C 44.47,22.15 35.43,22.15 33.97,23.61 RL3_1.1
  Top 1.27: RL3_1.1 v24.76,25.4 22.22,25.4 19.05,28.57 19.05,38.73 17.14,40.64 MOLEX_SL_70553-0012_13PIN.3
  Bottom 1.27: RB3_1.2 v24.76,25.4
  other vias: 26.04,25.4
  pour Bottom (no thermals): 27.94,26.67 27.94,27.3 14.61,27.3 14.61,23.49 27.94,23.49
C_IN3  (via drill 0.55 pad 1.1)
  Top 1.016: RC3_1.2 47.14,26.67 T1_7.C 44.59,28.57 35.56,28.57 33.97,30.16 RL4_1.1
  Top 1.27: RL4_1.1 v24.76,31.75 23.5,31.75 20.96,34.29 20.96,41.28 19.05,43.18 MOLEX_SL_70553-0012_13PIN.4
  Bottom 1.27: v24.76,31.75 RB4_1.2
  other vias: 26.04,31.75
  pour Bottom (no thermals): 27.94,33.66 14.61,33.66 14.61,29.85 27.94,29.85
C_IN4  (via drill 0.55 pad 1.1)
  Top 1.016: RC4_1.2 47.14,33.02 T1_8.C 44.59,34.93 35.56,34.93 33.97,36.51 RL5_1.1
  Top 1.27: RL5_1.1 v24.76,38.1 22.86,40.01 22.86,43.82 20.96,45.72 MOLEX_SL_70553-0012_13PIN.5
  Bottom 1.27: RB5_1.2 v24.76,38.1
  other vias: 26.04,38.1
  pour Bottom (no thermals): 27.94,39.37 27.94,40.01 14.61,40.01 14.61,36.2 27.94,36.2
C_IN5  (via drill 0.55 pad 1.1)
  Top 1.016: RC5_1.2 47.14,39.37 T1_5.C 44.59,41.28 35.56,41.28 33.97,42.86 RL6_1.1
  Top 1.27: RL6_1.1 v24.76,44.45 24.76,46.36 22.86,48.26 MOLEX_SL_70553-0012_13PIN.6
  Bottom 1.27: v24.76,44.45 RB6_1.2
  other vias: 26.04,44.45
  pour Bottom (no thermals): 27.94,46.36 14.61,46.36 14.61,42.55 27.94,42.55
C_IN6  (via drill 0.55 pad 1.1)
  Top 1.016: RC6_1.2 47.14,45.72 T1_6.C 44.59,47.62 35.56,47.62 33.97,49.21 RL7_1.1
  Top 1.27: RL7_1.1 v26.04,50.8 MOLEX_SL_70553-0012_13PIN.7
  Bottom 1.27: RB7_1.2 v26.04,50.8
  other vias: 24.76,50.8
  pour Bottom (no thermals): 27.94,52.07 27.94,52.71 14.61,52.71 14.61,48.9 27.94,48.9
C_IN7  (via drill 0.55 pad 1.1)
  Top 1.016: RC7_1.2 47.14,52.07 T1_9.C 44.59,53.98 35.56,53.98 33.97,55.56 RL8_1.1
  Top 1.27: RL8_1.1 v26.04,57.15 24.76,55.88 24.76,55.25 22.86,53.34 MOLEX_SL_70553-0012_13PIN.8
  Bottom 1.27: v26.04,57.15 RB8_1.2
  other vias: 25.4,56.52
  pour Bottom (no thermals): 27.94,59.05 14.61,59.05 14.61,55.25 27.94,55.25
C_IN8  (via drill 0.55 pad 1.1)
  Top 1.016: RC8_1.2 47.14,58.42 T1_10.C 44.59,60.32 35.56,60.32 33.97,61.91 RL9_1.1
  Top 1.27: RL9_1.1 v26.04,63.5 22.86,60.32 22.86,57.79 20.96,55.88 MOLEX_SL_70553-0012_13PIN.9
  other vias: 25.4,62.87
  pour Bottom (no thermals): 27.94,64.77 27.94,65.41 14.61,65.41 14.61,61.6 27.94,61.6
C_IN9  (via drill 0.55 pad 1.1)
  Top 1.016: RC9_1.2 47.14,64.77 T1_11.C 44.59,66.67 35.56,66.67 33.97,68.26 RL10_1.1
  Top 1.27: RL10_1.1 v24.76,69.85 22.86,69.85 20.96,67.94 20.96,60.32 19.05,58.42 MOLEX_SL_70553-0012_13PIN.10
  Bottom 1.27: v24.76,69.85 RB10_1.2
  other vias: 26.04,69.85
  pour Bottom (no thermals): 27.94,71.75 14.61,71.75 14.61,67.94 27.94,67.94
C_IN10  (via drill 0.55 pad 1.1)
  Top 1.016: RC10_1.2 47.14,71.12 T1_12.C 44.59,73.02 35.56,73.02 33.97,74.61 RL11_1.1
  Top 1.27: RL11_1.1 v24.76,76.2 19.68,76.2 19.05,75.56 19.05,62.87 17.14,60.96 MOLEX_SL_70553-0012_13PIN.11
  Bottom 1.27: v24.76,76.2 RB11_1.2
  other vias: 26.04,76.2
  pour Bottom (no thermals): 27.94,77.47 27.94,78.1 14.61,78.1 14.61,74.3 27.94,74.3
C_IN11  (via drill 0.55 pad 1.1)
  Top 1.016: RC11_1.2 47.14,77.47 T1_13.C 44.59,79.38 35.56,79.38 33.97,80.96 RL12_1.1
  Top 1.27: RL12_1.1 v24.76,82.55 17.78,82.55 17.14,81.91 17.14,65.41 15.24,63.5 MOLEX_SL_70553-0012_13PIN.12
  Bottom 1.27: v24.76,82.55 RB12_1.2
  other vias: 26.04,82.55
  pour Bottom (no thermals): 27.94,84.45 14.61,84.45 14.61,80.64 27.94,80.64
C_IN12
  Top 0.203: R4.2 70.17,41.59 68.53,43.23 68.53,83.16 66.67,85.02 66.67,85.09 66.04,85.72 50.8,85.72 49.85,84.77 RC12_1.2
  Top 0.254: R3.2 R4.2
  Top 1.016: RC12_1.2 47.14,83.82 T1_14.C 43.96,86.36
  Top 1.27: 43.96,86.36 15.87,86.36 15.24,85.72 15.24,67.94 13.33,66.04 MOLEX_SL_70553-0012_13PIN.13
CS  (via drill 0.55 pad 1.1)
  Top 0.254: MOLEX_SL_5.2 100.33,16.51 100.96,17.14 100.96,36.2 100.33,36.83 v97.16,36.83 R8.2
  Bottom 0.254: 96.52,41.91 96.52,37.47 v97.16,36.83 | JP1.3 85.72,48.9 87.63,46.99 91.44,46.99
  Bottom 0.305: 96.52,41.91 91.44,46.99
CS_OR_IMA
  Top 0.254: U1.41 89.09,26.38 89.53,26.82 89.53,48.26 88.27,49.53 88.27,52.07 87.63,52.71 JP1.2
DRIVE
  Top 0.254: U1.38 82.94,24.88 85.6,22.22 85.6,16.51 86.31,15.8 DZT5551-13.B
DTEN  (via drill 0.55 pad 1.1)
  Top 0.254: U1.36 81.86,23.88 v83.03,22.71 | v87.63,23.49 89.53,23.49 92.08,26.04 92.08,46.99 93.34,48.26 99.7,48.26 100.33,48.9 100.33,52.07 99.7,52.71 JP4.2
  Bottom 0.254: v87.63,23.49 86.84,22.71 v83.03,22.71
IBIAS
  Top 0.254: U1.45 78.47,28.38 78.19,28.66 78.19,35.33 R1.2
ICMP
  Top 0.254: R2.2 R1.1 | 82.55,41.28 83.19,40.64 83.19,37.47 78.74,33.02 78.74,29.15 78.97,28.92 79.7,28.92 U1.46
  Top 0.305: 82.55,41.28 R1.1
IMB
  Top 0.254: U1.47 85.89,29.38 | 76.2,46.99 74.93,48.26 74.93,57.79 | R6.1 75.24,60.64 76.2,61.6 76.2,65.41 73.02,68.58 73.02,76.83 74.58,78.39 U$1.9
  Top 0.305: 85.89,29.38 86.99,30.48 86.99,44.45 84.45,46.99 76.2,46.99 | R6.1 74.93,57.79
IPB
  Top 0.254: U1.48 85.05,29.88 | 85.72,43.18 83.19,45.72 75.56,45.72 73.34,47.94 R6.2 73.34,60.64 70.48,63.5 70.48,80.01 72.86,82.39 U$1.7
  Top 0.305: 85.05,29.88 85.72,30.55 85.72,43.18
ISO_OUTM_1
  Top 0.254: 1.1 96.52,83.19 95.72,82.39 U$1.6
ISO_OUTP_1
  Top 0.254: 2.1 100.33,81.28 97.44,78.39 U$1.4
ISOMD
  Top 0.254: U1.40 90.02,25.88 90.8,26.67 90.8,48.27 89.53,49.54 89.53,52.07 90.17,52.71 JP3.2
N$3
  Top 0.254: C6.1 74.3,65.72 71.75,68.26 71.75,78.74 73.41,80.39 U$1.8
N$5
  Top 0.254: C1.1 72.7,38.1 72.7,36.2 | 72.66,34.97 U1.1
  Top 0.305: 72.7,36.2 R3.1 72.66,34.97
N$7
  Top 0.254: JP2.1 79.25,57.9 R9.2 79.69,60.64 78.1,62.23 78.1,65.41 74.3,69.21 74.3,75.56 75.12,76.39 U$1.10
N$8
  Top 0.254: JP1.1 85.72,57.15 84.45,58.42 R9.1 81.59,60.64 82.55,61.6 82.55,65.41 77.39,70.56 77.39,72.31 U$1.12
N$9
  Top 0.254: C7.1 80.64,64.77 75.56,69.85 75.56,73.66 76.3,74.39 U$1.11
N$32  (via drill 0.55 pad 1.1)
  Top 1.27: LED1_11.2 v42.04,63.5 T1_11.E
  Bottom 1.27: v42.04,63.5 RB9_1.1
  other vias: 43.18,63.5
  pour Bottom (no thermals): 40.64,65.41 52.7,65.41 52.7,61.6 40.64,61.6
N$33
  Top 1.016: T1_11.G 47.14,62.23 RS9_1.2
N$34
  Top 1.016: RL9_1.2 LED1_11.1
N$35  (via drill 0.55 pad 1.1)
  Top 1.27: LED1_12.2 v42.04,69.85 T1_12.E
  Bottom 1.27: v42.04,69.85 RB10_1.1
  other vias: 43.18,69.85
  pour Bottom (no thermals): 40.64,71.75 52.7,71.75 52.7,67.94 40.64,67.94
N$36
  Top 1.016: T1_12.G 47.14,68.58 RS10_1.2
N$37
  Top 1.016: RL10_1.2 LED1_12.1
N$39  (via drill 0.55 pad 1.1)
  Top 1.27: LED1_13.2 v42.04,76.2 T1_13.E
  Bottom 1.27: v42.04,76.2 RB11_1.1
  other vias: 43.18,76.2
  pour Bottom (no thermals): 40.64,78.1 52.7,78.1 52.7,74.3 40.64,74.3
N$40  (via drill 0.55 pad 1.1)
  Top 1.27: LED1_3.2 v41.91,12.62 T1_3.E
  Bottom 1.27: v41.91,12.62 RB1_1.1
  other vias: 43.05,12.62
  pour Bottom (no thermals): 40.51,14.53 52.58,14.53 52.58,10.72 40.51,10.72
N$41
  Top 1.016: T1_3.G 47.01,11.35 RS1_1.2
N$42
  Top 1.016: RL1_1.2 LED1_3.1
N$43  (via drill 0.55 pad 1.1)
  Top 1.27: LED1_4.2 40.5,18.85 v41.91,18.85 44.37,18.85 T1_4.E
  Bottom 1.27: v41.91,18.85 38.29,18.85 RB2_1.1
  other vias: 43.05,18.85
  pour Bottom (no thermals): 40.51,20.88 52.58,20.88 52.58,17.07 40.51,17.07
N$44
  Top 1.016: T1_4.G 47.01,17.7 RS2_1.2
N$45
  Top 1.016: RL2_1.2 LED1_4.1
N$48  (via drill 0.55 pad 1.1)
  Top 1.27: LED1_5.2 v42.04,38.1 T1_5.E
  Bottom 1.27: v42.04,38.1 RB5_1.1
  other vias: 43.18,38.1
  pour Bottom (no thermals): 40.64,40.01 52.7,40.01 52.7,36.2 40.64,36.2
N$49
  Top 1.016: T1_5.G 47.14,36.83 RS5_1.2
N$50
  Top 1.016: RL5_1.2 LED1_5.1
N$51  (via drill 0.55 pad 1.1)
  Top 1.27: LED1_6.2 v42.04,44.45 T1_6.E
  Bottom 1.27: v42.04,44.45 RB6_1.1
  other vias: 43.18,44.45
  pour Bottom (no thermals): 40.64,46.36 52.7,46.36 52.7,42.55 40.64,42.55
N$52
  Top 1.016: T1_6.G 47.14,43.18 RS6_1.2
N$53
  Top 1.016: RL6_1.2 LED1_6.1
N$55  (via drill 0.55 pad 1.1)
  Top 1.27: LED1_9.2 v42.04,50.8 T1_9.E
  Bottom 1.27: v42.04,50.8 RB7_1.1
  other vias: 43.18,50.8
  pour Bottom (no thermals): 40.64,52.71 52.7,52.71 52.7,48.9 40.64,48.9
N$56  (via drill 0.55 pad 1.1)
  Top 1.27: LED1_7.2 v42.04,25.4 T1_7.E
  Bottom 1.27: v42.04,25.4 RB3_1.1
  other vias: 43.18,25.4
  pour Bottom (no thermals): 40.64,27.3 52.7,27.3 52.7,23.49 40.64,23.49
N$57
  Top 1.016: T1_7.G 47.14,24.13 RS3_1.2
N$58
  Top 1.016: RL3_1.2 LED1_7.1
N$59  (via drill 0.55 pad 1.1)
  Top 1.27: LED1_8.2 v42.04,31.75 T1_8.E
  Bottom 1.27: v42.04,31.75 RB4_1.1
  other vias: 43.18,31.75
  pour Bottom (no thermals): 40.64,33.66 52.7,33.66 52.7,29.85 40.64,29.85
N$60
  Top 1.016: T1_8.G 47.14,30.48 RS4_1.2
N$61
  Top 1.016: RL4_1.2 LED1_8.1
N$62
  Top 1.016: T1_13.G 47.14,74.93 RS11_1.2
N$63
  Top 1.016: T1_9.G 47.14,49.53 RS7_1.2
N$64
  Top 1.016: RL7_1.2 LED1_9.1
N$65  (via drill 0.55 pad 1.1)
  Top 1.27: LED1_10.2 v42.04,57.15 T1_10.E
  Bottom 1.27: v42.04,57.15 RB8_1.1
  other vias: 43.18,57.15
  pour Bottom (no thermals): 40.64,59.05 52.7,59.05 52.7,55.25 40.64,55.25
N$66
  Top 1.016: T1_10.G 47.14,55.88 RS8_1.2
N$67
  Top 1.016: RL8_1.2 LED1_10.1
N$69
  Top 1.016: RL11_1.2 LED1_13.1
N$70  (via drill 0.55 pad 1.1)
  Top 1.27: LED1_14.2 v42.04,82.55 T1_14.E
  Bottom 1.27: v42.04,82.55 RB12_1.1
  other vias: 43.18,82.55
  pour Bottom (no thermals): 40.64,84.45 52.7,84.45 52.7,80.64 40.64,80.64
N$71
  Top 1.016: T1_14.G 47.14,81.28 RS12_1.2
N$72
  Top 1.016: RL12_1.2 LED1_14.1
S1
  Top 0.203: RS1_1.1 52.26,10.72 52.58,10.72 53.21,10.08 57.02,10.08 57.66,10.72 57.66,12.62 58.37,13.33 66.63,13.33 66.65,13.36 68.17,14.88 68.17,17.37 68.58,17.78 69.85,17.78 71.12,16.51 79.38,16.51 80.01,17.14 80.01,18.11 U1.25
S2
  Top 0.203: RS2_1.1 52.26,17.07 52.58,17.07 53.21,16.43 57.02,16.43 57.66,17.07 57.66,18.97 58.29,19.61 58.37,19.68 68,19.68 68.73,18.96 72.58,18.96 U1.23
S3
  Top 0.203: RS3_1.1 52.38,23.49 52.7,23.49 53.34,22.86 57.15,22.86 57.78,23.49 57.78,25.4 58.42,26.04 62.86,26.04 69.02,19.88 U1.21
S4
  Top 0.203: RS4_1.1 52.38,29.85 52.7,29.85 53.34,29.21 57.15,29.21 57.78,29.85 57.78,31.75 58.42,32.39 59.69,32.39 60.33,31.75 60.33,29.85 69.29,20.88 U1.19
S5
  Top 0.203: RS5_1.1 52.38,36.2 52.7,36.2 53.34,35.56 57.15,35.56 57.78,36.2 57.78,38.1 58.42,38.73 60.55,38.73 61.19,38.1 61.19,30.28 69.59,21.88 U1.17
S6
  Top 0.203: RS6_1.1 52.38,42.55 52.7,42.55 53.34,41.91 57.15,41.91 57.78,42.55 57.78,44.45 58.42,45.09 61.59,45.09 62,44.68 62,30.62 69.76,22.86 72.64,22.86 U1.15
S7
  Top 0.203: RS7_1.1 52.38,48.9 52.7,48.9 53.34,48.26 57.15,48.26 57.78,48.9 57.78,50.8 58.42,51.44 62.23,51.44 62.86,50.8 62.86,30.98 69.96,23.88 U1.13
S8
  Top 0.203: RS8_1.1 52.38,55.25 52.7,55.25 53.34,54.61 57.15,54.61 57.78,55.25 57.78,57.15 58.42,57.79 63.22,57.79 63.86,57.15 63.86,31.28 70.25,24.88 U1.11
S9
  Top 0.203: RS9_1.1 52.38,61.6 52.7,61.6 53.34,60.96 57.15,60.96 57.78,61.6 57.78,63.5 58.42,64.13 64.13,64.13 64.77,63.5 64.77,31.66 70.55,25.88 | U1.9 70.55,25.88 | 70.55,25.88
S10
  Top 0.203: RS10_1.1 52.38,67.94 52.7,67.94 53.34,67.31 57.15,67.31 57.78,67.94 57.78,69.85 58.42,70.48 64.49,70.48 65.76,69.21 65.76,31.96 70.84,26.88 U1.7
S11
  Top 0.203: RS11_1.1 52.38,74.3 52.7,74.3 53.34,73.66 57.15,73.66 57.78,74.3 57.78,76.2 58.42,76.83 66.04,76.83 66.67,76.2 66.67,32.34 71.11,27.9 72.63,27.9 U1.5
S12
  Top 0.203: RS12_1.1 52.38,80.64 52.7,80.64 53.34,80.01 57.15,80.01 57.78,80.64 57.78,82.55 58.42,83.19 67.03,83.19 67.67,82.55 67.67,32.64 71.4,28.9 72.63,28.9 U1.3
SCK  (via drill 0.55 pad 1.1)
  Top 0.254: v95.88,35.56 94.61,34.29 R5.2 | MOLEX_SL_5.1 99.7,19.05 100.33,19.68 100.33,34.95 99.72,35.56 v98.45,35.56
  Bottom 0.254: v98.45,35.56 v95.88,35.56 95.88,41.28 90.8,46.36 80.64,46.36 79.25,47.75 JP2.3
SCK_OR_IPA
  Top 0.254: U1.42 87.84,26.88 88.27,27.3 88.27,45.72 | 85.72,48.26 83.19,48.26 81.91,49.53 81.91,52.07 81.28,52.71 JP2.2
  Top 0.305: 88.27,45.72 85.72,48.26
SDI  (via drill 0.55 pad 1.1)
  Top 0.203: U1.43 79.78,27.34
  Top 0.254: v86.99,27.94 86.36,27.34 79.78,27.34 | MOLEX_SL_5.4 95.88,11.43 94.61,12.7 94.61,21.59 97.16,24.13 98.11,24.13 R7.2 98.11,27.62 97.79,27.94 v97.16,27.94
  Bottom 0.305: v86.99,27.94 v97.16,27.94
SDO  (via drill 0.55 pad 1.1)
  Top 0.254: U1.44 79.77,27.9 85.69,27.9 v86.99,29.21 | v97.16,29.21 99.06,29.21 99.7,28.57 99.7,23.49 99.06,22.86 97.16,22.86 95.25,20.95 95.25,14.61 95.88,13.97 MOLEX_SL_5.3
  Bottom 0.305: v86.99,29.21 v97.16,29.21
V-_1  (via drill 0.55 pad 1.1)
  Top 0.152: 80.68,62.51 C7.2
  Top 0.254: U1.31 U1.30 | C1.2 v75.56,37.47
  Top 0.305: U1.30 80.69,20.88 | C5.2 83.82,8.32 | 79.71,21.4 U1.31
  Top 0.508: C2.2 C3.2 C4.2 83.82,8.32 | R2.1 C1.2 | 80.69,20.88 81.91,19.72 81.91,8.89 | 81.91,8.89 82.55,8.25 83.82,8.32 | C6.2 v74.3,60.32 | v80.68,60.32 80.68,62.51 | 83.82,8.32 82.17,6.67 C8.2 54.43,6.49 L1.2 | C2.2 93.28,8.25 | C2.2 95.95,8.32 MOLEX_SL_5.5 | 81.91,8.89 v81.28,8.25
  pour Bottom: 59.69,86.36 88.27,86.36 88.27,69.04 103.51,69.04 103.51,1.91 59.69,1.91
VREF1_C4
  Top 0.254: U1.35 79.77,23.36 81.04,23.36 84.07,20.32 84.07,14.86 86.87,12.06 C4.1
VREF2_C5
  Top 0.254: U1.34 79.77,22.86 80.53,22.86 80.53,22.85 83.31,20.07 83.31,10.6 C5.1
VREG  (via drill 0.55 pad 1.1)
  Top 0.254: JP4.1 JP3.1 | 90.04,14.13 DZT5551-13.E 91.71,14.34 v92.71,13.33 | 90.04,14.13 C3.1 | U1.37 79.77,24.36 82.66,24.36 84.84,22.18 84.84,15.37 86.07,14.13 90.04,14.13 | 93.98,31.11 93.34,31.75 93.34,38.1 93.98,38.73 100.33,38.73 | 95.88,25.4 94.61,25.4 v94.61,23.49
  Top 0.305: R8.1 R5.1 | JP4.1 99.7,55.25 100.96,53.98 100.96,39.37 100.33,38.73 | R5.1 94.61,25.4 | R7.1 95.88,25.4 | R5.1 93.98,31.11
  Bottom 0.254: v94.61,23.49 92.71,21.59 v92.71,13.33
VREG_CAP  (via drill 0.55 pad 1.1)
  Top 0.254: 93.85,21.34 93.85,10.22 | 87.6,21.62 v84.45,24.76 | 84.45,41.91 81.91,44.45 74.3,44.45 72.39,42.55 72.39,40.64
  Top 0.305: DZT5551-13.C 93.49,21.7 93.85,21.34 | 93.85,10.22 C2.1 | DZT5551-13.C@2 DZT5551-13.C | DZT5551-13.C 87.6,21.62 | v84.45,31.11 84.45,41.91 | R4.1 72.39,40.64
  Bottom 0.305: v84.45,24.76 v84.45,31.11
XOUT1_1
  Top 0.254: U$1.1 92.71,72.39 93.34,73.02 MOLEX_SL_2.2
XOUT3_1
  Top 0.254: U$1.3 91.79,76.2 92.71,76.2 93.34,75.56 MOLEX_SL_2.1

### Text on the board
tPlace: M3 Screw. Major Diam: .115 in | 1 | 1 | 1 | 1 | 0 | 0 | 0 | 0 | JP2 | JP1 | JP3 | JP4